# Altium schematic sheet fpc.SchDoc
size A
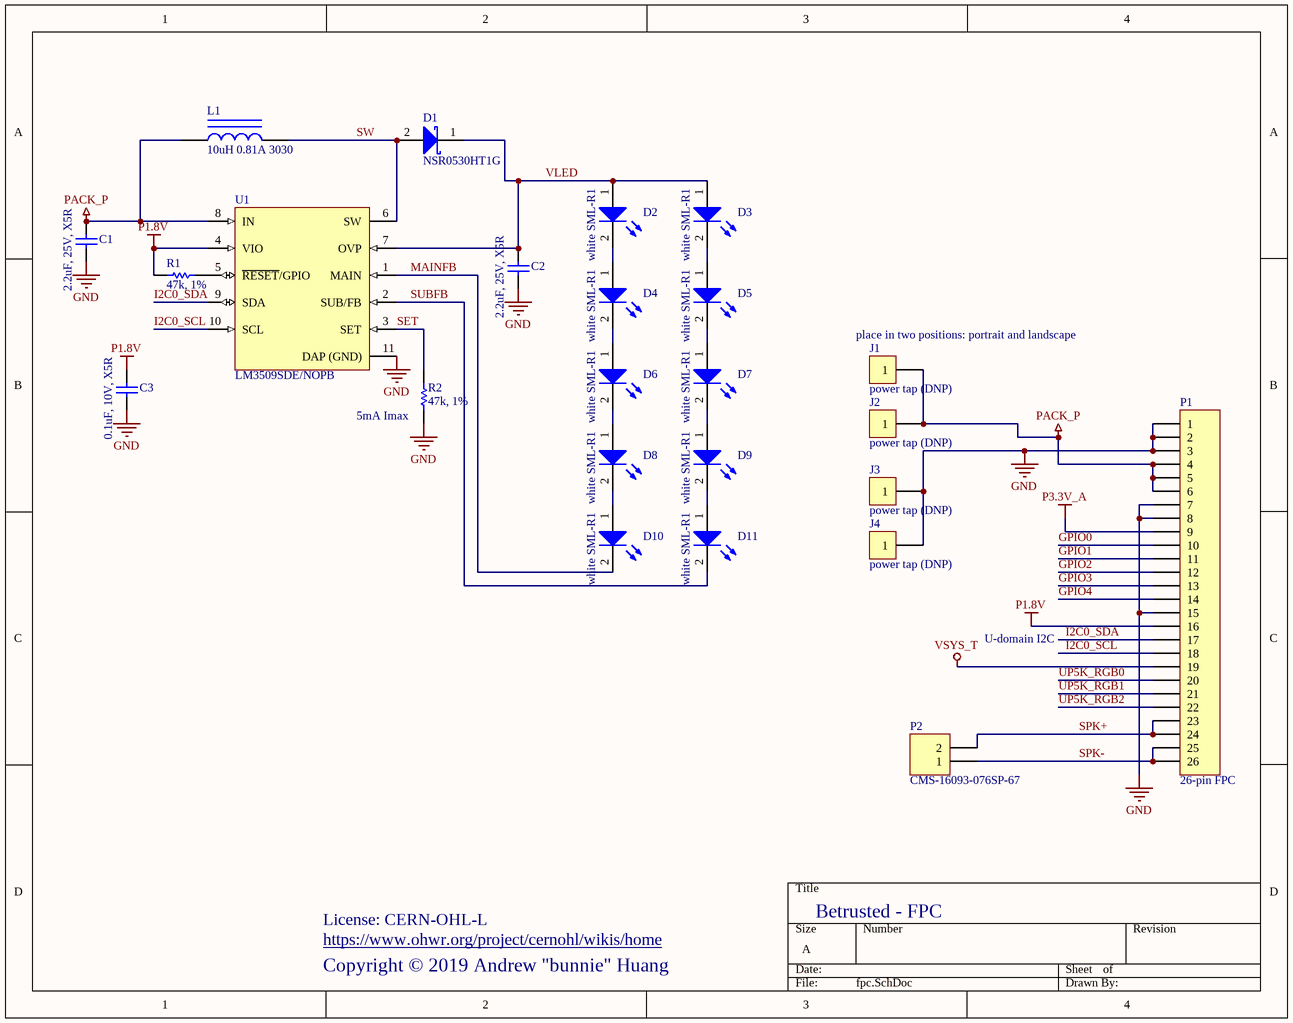
[diagram p0: fpc.SchDoc]

## Parts
C1  2.2uF, 25V, X5R  [B_CAP0603]
C2  2.2uF, 25V, X5R  [B_CAP0603]
C3  0.1uF, 10V, X5R  [B_CAP0402]
D1  NSR0530HT1G  [SOD-323]
D2  white SML-R1  [ROHM_SML-R1]
D3  white SML-R1  [ROHM_SML-R1]
D4  white SML-R1  [ROHM_SML-R1]
D5  white SML-R1  [ROHM_SML-R1]
D6  white SML-R1  [ROHM_SML-R1]
D7  white SML-R1  [ROHM_SML-R1]
D8  white SML-R1  [ROHM_SML-R1]
D9  white SML-R1  [ROHM_SML-R1]
D10  white SML-R1  [ROHM_SML-R1]
D11  white SML-R1  [ROHM_SML-R1]
J1  power tap (DNP)  [RESTAP-0603]
J2  power tap (DNP)  [RESTAP-0603]
J3  power tap (DNP)  [RESTAP-0603]
J4  power tap (DNP)  [RESTAP-0603]
L1  10uH 0.81A 3030  [B_IND3030_MUR]
P1  26-pin FPC  [HRS_FH34SRJ-26S-FPC]
P2  CMS-16093-076SP-67  [CUI_CMS-16093-076SP-67]
R1  47k, 1%  [B_RES0402]
R2  47k, 1%  [B_RES0402]
U1  LM3509SDE/NOPB  [DSC0010A_V]

## Nets
GND: C1.2 C2.2 C3.2 J3.1 J4.1 P1.1 P1.2 P1.3 P1.7 P1.8 P1.15 R2.2 U1.11(DAP_(GND))
P1.8V: C3.1 P1.16 R1.1 U1.4(VIO)
P3.3V_A: P1.9
PACK_P: C1.1 J1.1 J2.1 L1.1 P1.4 P1.5 P1.6 U1.8(IN)
VSYS_T: P1.19
GPIO0: P1.10
GPIO1: P1.11
GPIO2: P1.12
GPIO3: P1.13
GPIO4: P1.14
I2C0_SCL: P1.18 U1.10(SCL)
I2C0_SDA: P1.17 U1.9(SDA)
MAINFB: D10.2(K) U1.1(MAIN)
SET: R2.1 U1.3(SET)
SPK+: P1.23 P1.24 P2.2
SPK-: P1.25 P1.26 P2.1
SUBFB: D11.2(K) U1.2(SUB/FB)
SW: D1.2(A) L1.2 U1.6(SW)
UP5K_RGB0: P1.20
UP5K_RGB1: P1.21
UP5K_RGB2: P1.22
VLED: C2.1 D1.1(K) D2.1(A) D3.1(A) U1.7(OVP)
NetD2_2: D2.2(K) D4.1(A)
NetD3_2: D3.2(K) D5.1(A)
NetD4_2: D4.2(K) D6.1(A)
NetD5_2: D5.2(K) D7.1(A)
NetD6_2: D6.2(K) D8.1(A)
NetD7_2: D7.2(K) D9.1(A)
NetD8_2: D8.2(K) D10.1(A)
NetD9_2: D9.2(K) D11.1(A)
NetR1_2: R1.2 U1.5(~{RESET}/GPIO)

## Notes on the sheet
- (near J1) place in two positions: portrait and landscape
- (near R2) 5mA Imax
- U-domain I2C
- License: CERN-OHL-L
- Copyright © 2019 Andrew "bunnie" Huang
- https://www.ohwr.org/project/cernohl/wikis/home
- Betrusted - FPC

## Library data of the parts
C1 C2 = Cap Semi: Capacitor (Semiconductor SIM Model); MPN: GRM188R61E225MA12D; VENDOR: Murata; MYPN: C-225-25-X5R-0603
C3 = Cap Semi: Capacitor (Semiconductor SIM Model); MPN: CL05A104KP5NNNC; VENDOR: Samsung; MYPN: C-104-10-X5R-0402
D1 = Diode 11DQ03: Schottky Rectifier; MYPN: D-NSR0530HT1G; VENDOR: On Semi; ComponentLink1Description: Manufacturer Link; ComponentLink1URL: http://www.irf.com/; ComponentLink2Description: Datasheet; ComponentLink2URL: http://www.irf.com/product-info/datasheets/data/11dq03.pdf; MPN: NSR0530HT1G
D2-D11 = LED2: Red LED; MPN: SMLR13WBDW; MYPN: D-LED-WHT-SIDE-0.2mm; VENDOR: ROHM; Published: 8-Jun-2000; LatestRevisionDate: 17-Jul-2002; LatestRevisionNote: Re-released for DXP Platform.; PackageVersion: Feb-2002; PackageReference: 3.2X1.6X1.1; Publisher: Altium Limited
J1-J4 = CON1: Connector; MYPN: J-TP-PWRTAP-0603; MPN: DNP; VENDOR: DNP
L1 = Inductor Iron: Magnetic-Core Inductor; MPN: LQH3NPN100MJRL; VENDOR: Murata; MYPN: L-LQH3NPN100MJRL
P1 = FPC-26: 26 Pin FPC footprint; MPN: DNP; VENDOR: FPC pattern; System: Connector; MYPN: DNP
P2 = Header 2: MYPN: SPK-CMS-16093-076SP-67; VENDOR: CUI; LatestRevisionDate: 17-Jul-2002; LatestRevisionNote: Re-released for DXP Platform.; Publisher: Altium Limited; MPN: CMS-16093-076SP-67
R1 R2 = Res1: Resistor; VENDOR: ANY; MYPN: R-473-1P-1_16W-0402; MPN: ANY
U1 = LM3509SDE/NOPB: MYPN: U-LM3509SDE/NOPB; VENDOR: TI; MPN: LM3509SDE/NOPB